# Altium schematic sheet Connectors.SchDoc
size A4; DocumentNumber: 2; SheetNumber: 2; SheetTotal: 21; SheetName: Connectors
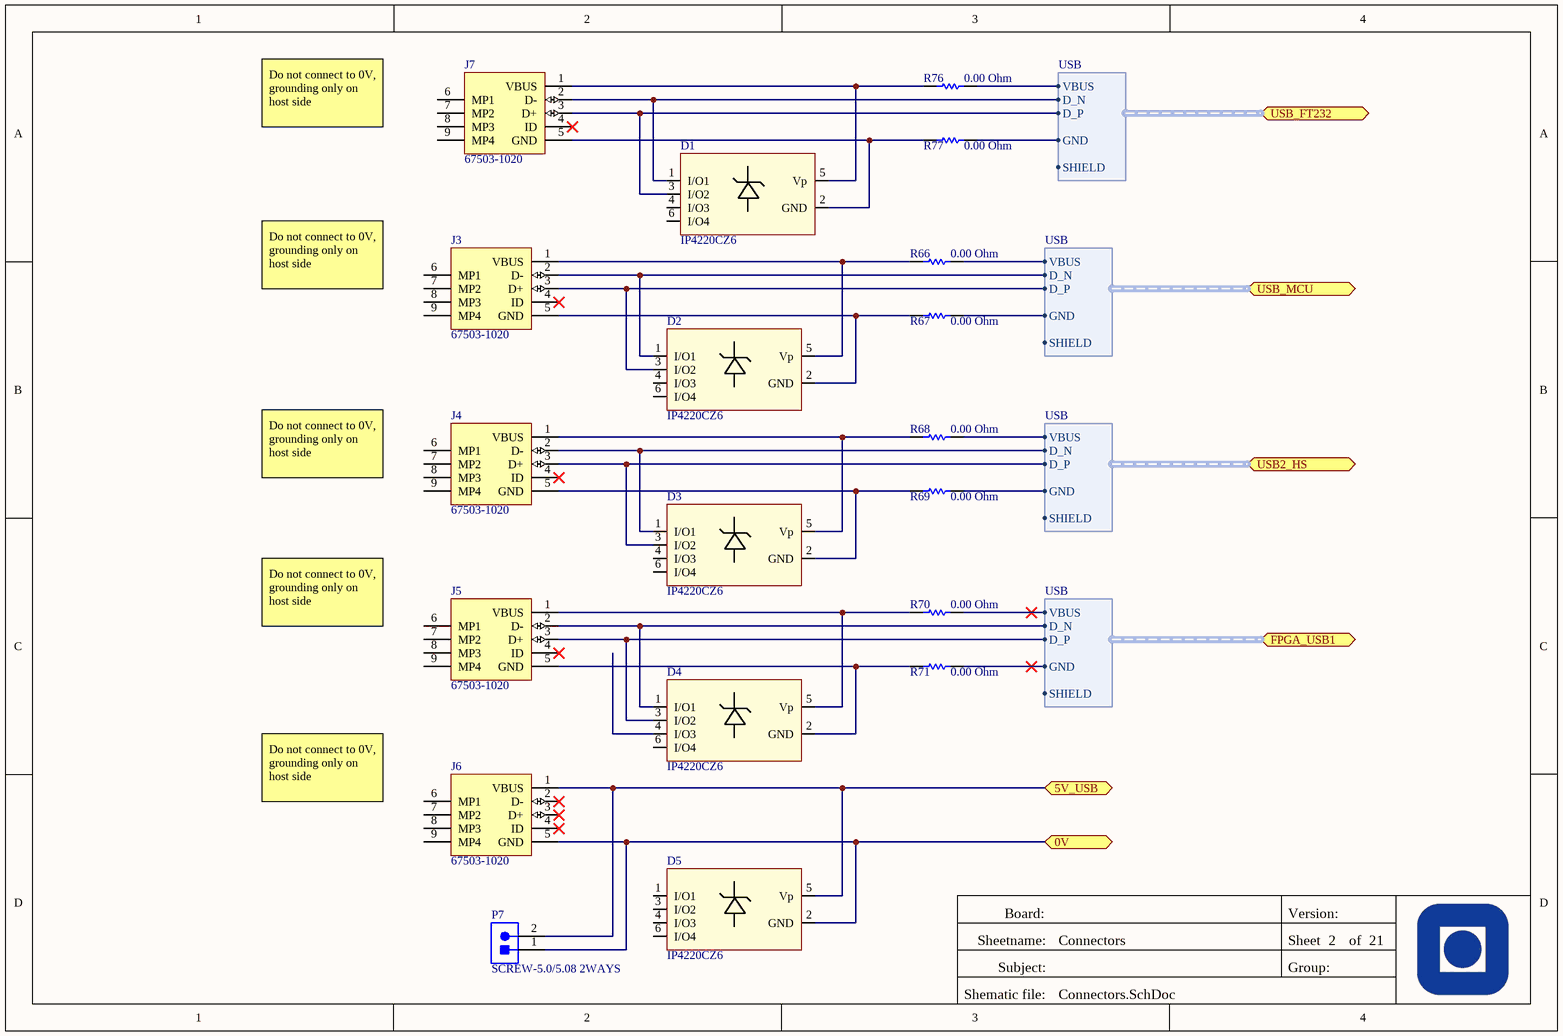
[diagram p0: Connectors.SchDoc]

## Parts
D1  IP4220CZ6  [NXP SOT457]
D2  IP4220CZ6  [NXP SOT457]
D3  IP4220CZ6  [NXP SOT457]
D4  IP4220CZ6  [NXP SOT457]
D5  IP4220CZ6  [NXP SOT457]
J3  67503-1020  [MOLX-67503-1020_V]
J4  67503-1020  [MOLX-67503-1020_V]
J5  67503-1020  [MOLX-67503-1020_V]
J6  67503-1020  [MOLX-67503-1020_V]
J7  67503-1020  [MOLX-67503-1020_V]
P7  SCREW-5.0/5.08 2WAYS  [SCREW-5.0-2WAYS_V]
R66  value 0.00 Ohm  [RESC0603(1608)_N]  (hidden comment: Jumper 0603(1608))
R67  value 0.00 Ohm  [RESC0603(1608)_N]  (hidden comment: Jumper 0603(1608))
R68  value 0.00 Ohm  [RESC0603(1608)_N]  (hidden comment: Jumper 0603(1608))
R69  value 0.00 Ohm  [RESC0603(1608)_N]  (hidden comment: Jumper 0603(1608))
R70  value 0.00 Ohm  [RESC0603(1608)_N]  (hidden comment: Jumper 0603(1608))
R71  value 0.00 Ohm  [RESC0603(1608)_N]  (hidden comment: Jumper 0603(1608))
R76  value 0.00 Ohm  [RESC0603(1608)_N]  (hidden comment: Jumper 0603(1608))
R77  value 0.00 Ohm  [RESC0603(1608)_N]  (hidden comment: Jumper 0603(1608))

## Ports
0V, 5V_USB, FPGA_USB1 (harness USB), USB2_HS (harness USB), USB_FT232 (harness USB), USB_MCU (harness USB)

## Harnesses
USB: D_P, D_N, VBUS, GND, SHIELD

## Nets
0V: D5.2(GND) J6.5(GND) P7.1 ; port 0V
5V_USB: D5.5(Vp) J6.1(VBUS) P7.2 ; port 5V_USB
NetD1_1: D1.1(I/O1) J7.2(D-) ; port USB_FT232.D_N
NetD1_2: D1.2(GND) J7.5(GND) R77.1
NetD1_3: D1.3(I/O2) J7.3(D+) ; port USB_FT232.D_P
NetD1_5: D1.5(Vp) J7.1(VBUS) R76.1
NetD2_1: D2.1(I/O1) J3.2(D-) ; port USB_MCU.D_N
NetD2_2: D2.2(GND) J3.5(GND) R67.1
NetD2_3: D2.3(I/O2) J3.3(D+) ; port USB_MCU.D_P
NetD2_5: D2.5(Vp) J3.1(VBUS) R66.1
NetD3_1: D3.1(I/O1) J4.2(D-) ; port USB2_HS.D_N
NetD3_2: D3.2(GND) J4.5(GND) R69.1
NetD3_3: D3.3(I/O2) J4.3(D+) ; port USB2_HS.D_P
NetD3_5: D3.5(Vp) J4.1(VBUS) R68.1
NetD4_1: D4.1(I/O1) J5.2(D-) ; port FPGA_USB1.D_N
NetD4_2: D4.2(GND) J5.5(GND) R71.1
NetD4_3: D4.3(I/O2) J5.3(D+) ; port FPGA_USB1.D_P
NetD4_5: D4.5(Vp) J5.1(VBUS) R70.1
NetR66_2: R66.2 ; port USB_MCU.VBUS
NetR67_2: R67.2 ; port USB_MCU.GND
NetR68_2: R68.2 ; port USB2_HS.VBUS
NetR69_2: R69.2 ; port USB2_HS.GND
NetR70_2: R70.2 ; port FPGA_USB1.VBUS
NetR71_2: R71.2 ; port FPGA_USB1.GND
NetR76_2: R76.2 ; port USB_FT232.VBUS
NetR77_2: R77.2 ; port USB_FT232.GND

Not connected (* = marked no-connect by the designer): D1 4(I/O3) 6(I/O4); D2 4(I/O3) 6(I/O4); D3 4(I/O3) 6(I/O4); D4 4(I/O3) 6(I/O4); D5 1(I/O1) 3(I/O2) 4(I/O3) 6(I/O4); J3 4(ID)* 6(MP1) 7(MP2) 8(MP3) 9(MP4); J4 4(ID)* 6(MP1) 7(MP2) 8(MP3) 9(MP4); J5 4(ID)* 6(MP1) 7(MP2) 8(MP3) 9(MP4); J6 2(D-)* 3(D+)* 4(ID)* 6(MP1) 7(MP2) 8(MP3) 9(MP4); J7 4(ID)* 6(MP1) 7(MP2) 8(MP3) 9(MP4)

## Notes on the sheet
- Do not connect to 0V, grounding only on host side
- Board:
- Version:
- Sheetname:
- Subject:
- Group:
- Sheet
- of
- Shematic file:

## Library data of the parts
D1-D5 = IP4220CZ6: 4 channel USB ESD protection device; Supplier 1: Digi-Key; Supplier Part Number 1: 568-3529-2-ND
J3-J7 = CMP-0411-00002-1: USB, MINI, SMD, RA KME04-USBMU03A01; Manufacturer: Molex; ComponentLink1URL: http://www.molex.com/; PartNumber: 67503-1020; Mounting Technology: Surface Mount; ComponentLink1Description: Manufacturer URL; Terminal Pitch: 0.8 mm; DatasheetVersion: Rev F, 06/2009; ComponentLink2Description: Datasheet; PackageDescription: Mini USB Connector, SMT, Righer Angle; ComponentLink2URL: http://www.molex.com/pdm_docs/sd/675031020_sd.pdf; PackageReference: 67503-1020
P7 = CMP-0617-00009-1: Socket, Screw Terminal Block, 2 Way, 5.0 mm Pitch, 90 Degree Angle, Through-Hole; Manufacturer: No Vendor; Insulation Resistance: 5000 MOhm / 1000 V; Contact Resistance: 20 mOhm; Rated Current: 25 A; Poles: 2; Rated Voltage: 300 V; PartNumber: SCREW-5.0/5.08 2WAYS; ComponentLink1Description: Datasheet; ComponentLink1URL: 5mm screw terminal in SVN; Mounting Technology: Through Hole; PackageDescription: Socket, Screw Terminal Block, 2 Way, Pitch 5 mm, 90 Degree Angle, Through-Hole; Temperature Range: -40 to 105 degC
R66-R71 R76 R77 = CMP-1012-00001-1: Jumper 0603 (1608 Metric); Case-Metric: 1608; Power: None; Case-EIA: 0603; Technology: SMT; Tolerance: None